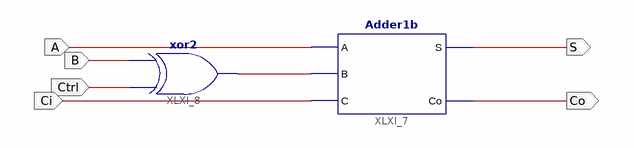
[diagram p0: schematic sheet 1]
// Xilinx ISE schematic AddSub1b.sch (kintex7) as structural Verilog: 2 symbols, 6 ports
module AddSub1b (
  input  A,
  input  B,
  input  Ctrl,
  input  Ci,
  output S,
  output Co
);

  wire XLXN_19;

  Adder1b XLXI_7 (.A(A), .B(XLXN_19), .C(Ci), .S(S), .Co(Co));
  xor XLXI_8 (XLXN_19, Ctrl, B);
endmodule
